# EAGLE design plaits_5u_ioboard (EAGLE 9.1.3)

## Sheet 1 of 2
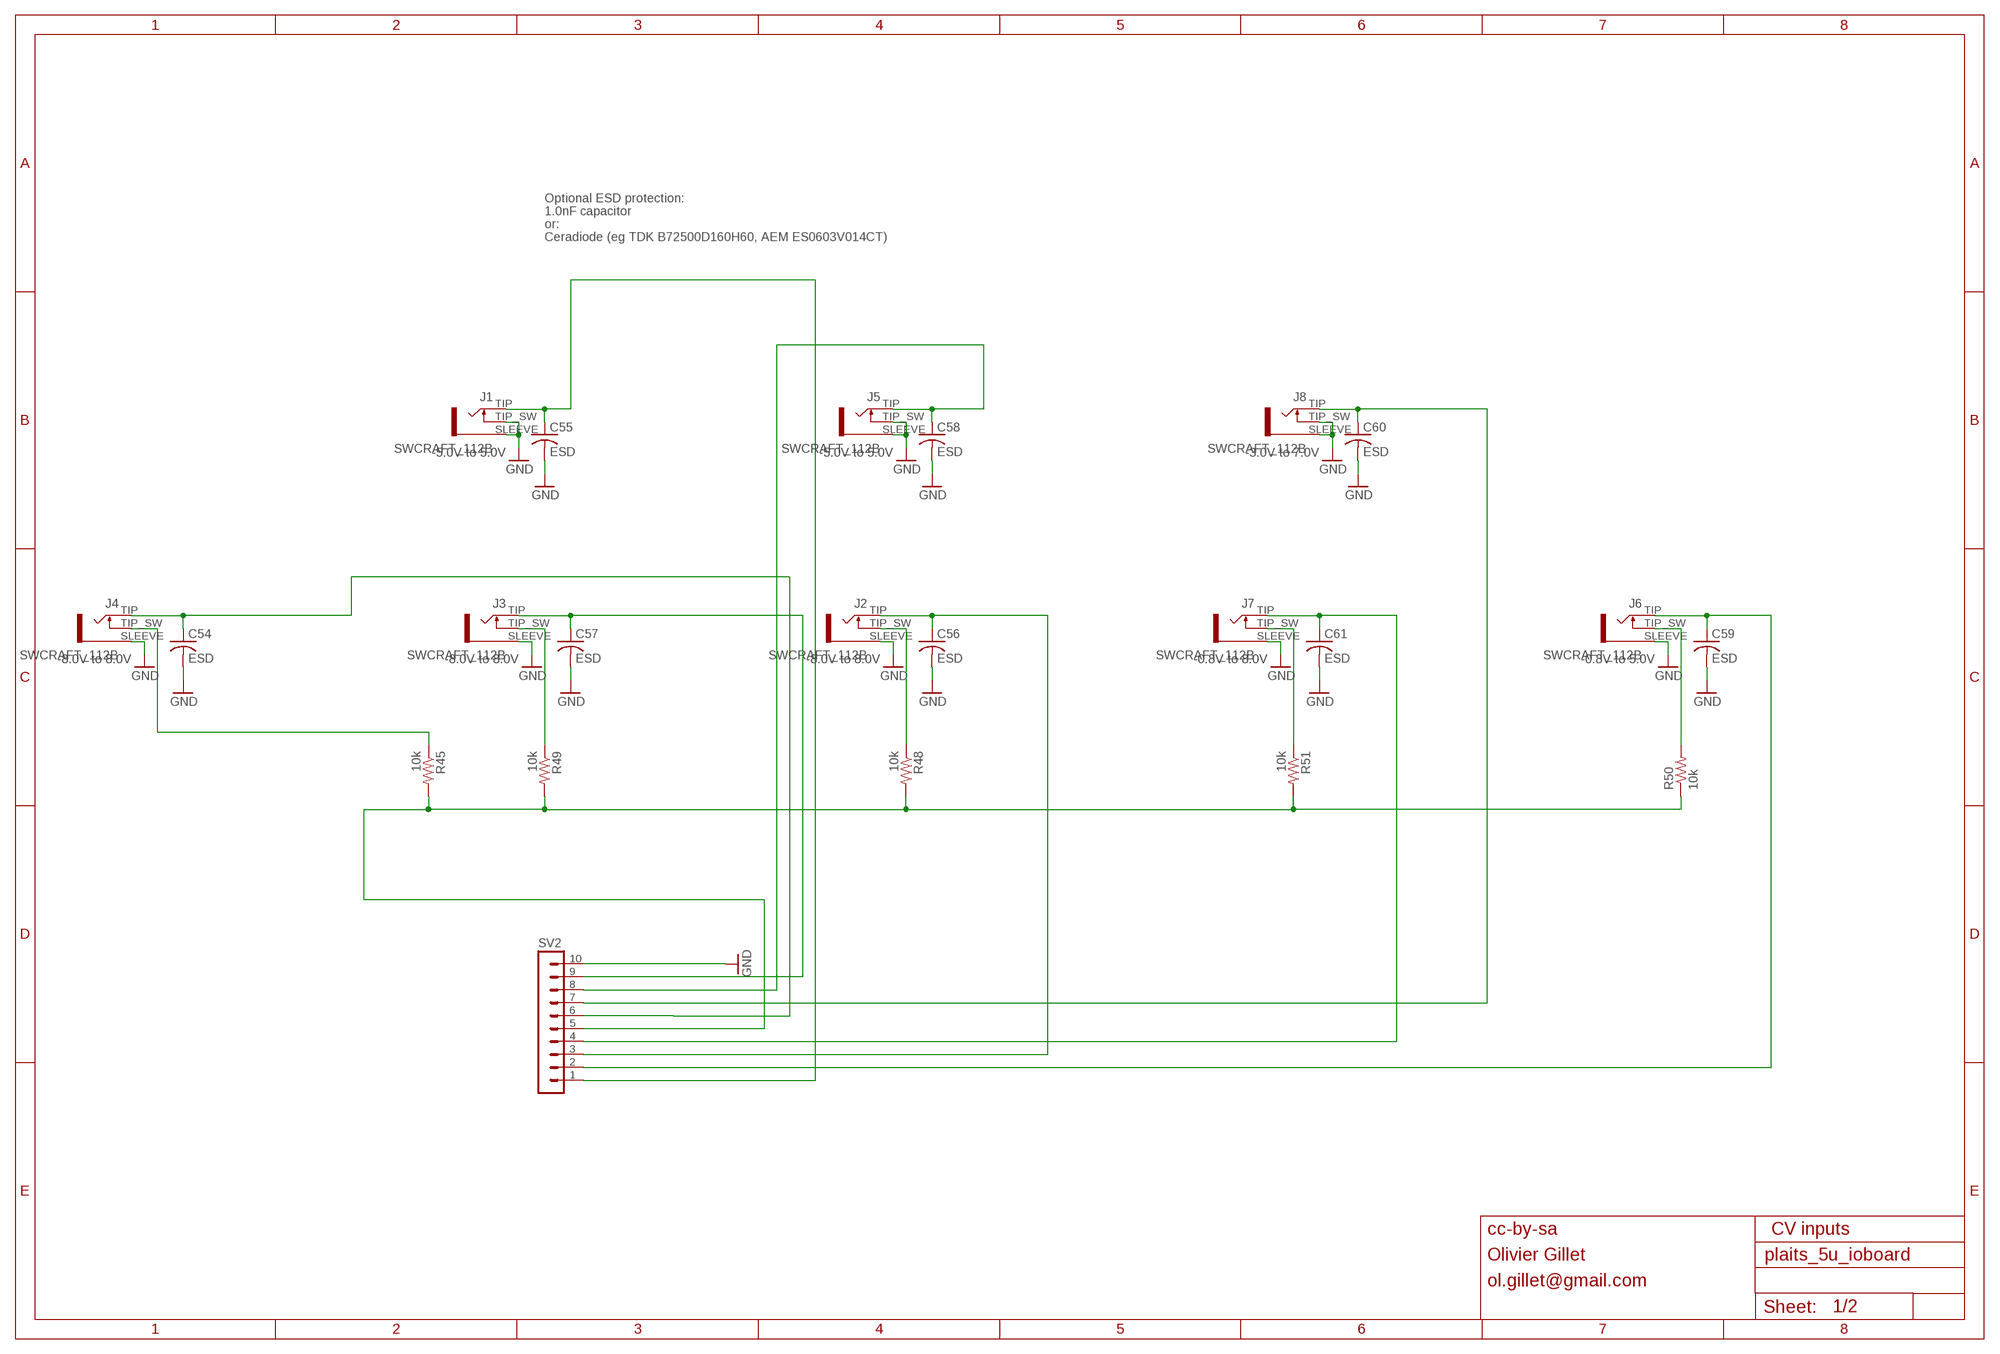
[diagram p0: schematic, sheet 1]

### Parts
C54  ESD  C-USC0805  [C0805]
C55  ESD  C-USC0805  [C0805]
C56  ESD  C-USC0805  [C0805]
C57  ESD  C-USC0805  [C0805]
C58  ESD  C-USC0805  [C0805]
C59  ESD  C-USC0805  [C0805]
C60  ESD  C-USC0805  [C0805]
C61  ESD  C-USC0805  [C0805]
J1  SWCRAFT_112B  [SWCRAFT_112_SLOTS]
J2  SWCRAFT_112B  [SWCRAFT_112_SLOTS]
J3  SWCRAFT_112B  [SWCRAFT_112_SLOTS]
J4  SWCRAFT_112B  [SWCRAFT_112_SLOTS]
J5  SWCRAFT_112B  [SWCRAFT_112_SLOTS]
J6  SWCRAFT_112B  [SWCRAFT_112_SLOTS]
J7  SWCRAFT_112B  [SWCRAFT_112_SLOTS]
J8  SWCRAFT_112B  [SWCRAFT_112_SLOTS]
R45  10k  R-US_R0805  [R0805]
R48  10k  R-US_R0805  [R0805]
R49  10k  R-US_R0805  [R0805]
R50  10k  R-US_R0805  [R0805]
R51  10k  R-US_R0805  [R0805]
SV2  MA10-1  [MA10-1]

### Nets
FM_IN: C57.1 J3.TIP SV2.9
GATE_IN: C61.1 J7.TIP SV2.4
GATE_IN1: C59.1 J6.TIP SV2.2
GND: C54.2 C55.2 C56.2 C57.2 C58.2 C59.2 C60.2 C61.2 J1.SLEEVE J1.TIP_SW J2.SLEEVE J3.SLEEVE J4.SLEEVE J5.SLEEVE J5.TIP_SW J6.SLEEVE J7.SLEEVE J8.SLEEVE J8.TIP_SW SV2.10 ; also sheet 2
HARMONICS_IN: C58.1 J5.TIP SV2.8
MODEL_IN: C55.1 J1.TIP SV2.1
MORPH_IN: C54.1 J4.TIP SV2.6
N$3: J6.TIP_SW R50.2
N$24: J3.TIP_SW R49.1
N$25: J2.TIP_SW R48.1
N$26: J4.TIP_SW R45.1
N$31: C56.1 J2.TIP SV2.3
N$36: J7.TIP_SW R51.1
NORMALIZATION_PROBE: R45.2 R48.2 R49.2 R50.1 R51.2 SV2.5
V_OCT_IN: C60.1 J8.TIP SV2.7

### Notes on the sheet
- Optional ESD protection:
- 1.0nF capacitor
- or:
- Ceradiode (eg TDK B72500D160H60, AEM ES0603V014CT)
- -5.0V to 5.0V | -5.0V to 5.0V | -3.0V to 7.0V
- -8.0V to 8.0V | -8.0V to 8.0V | -8.0V to 8.0V | -0.8V to 8.0V | -0.8V to 5.0V
- cc-by-sa | CV inputs
- Olivier Gillet
- ol.gillet@gmail.com

## Sheet 2 of 2
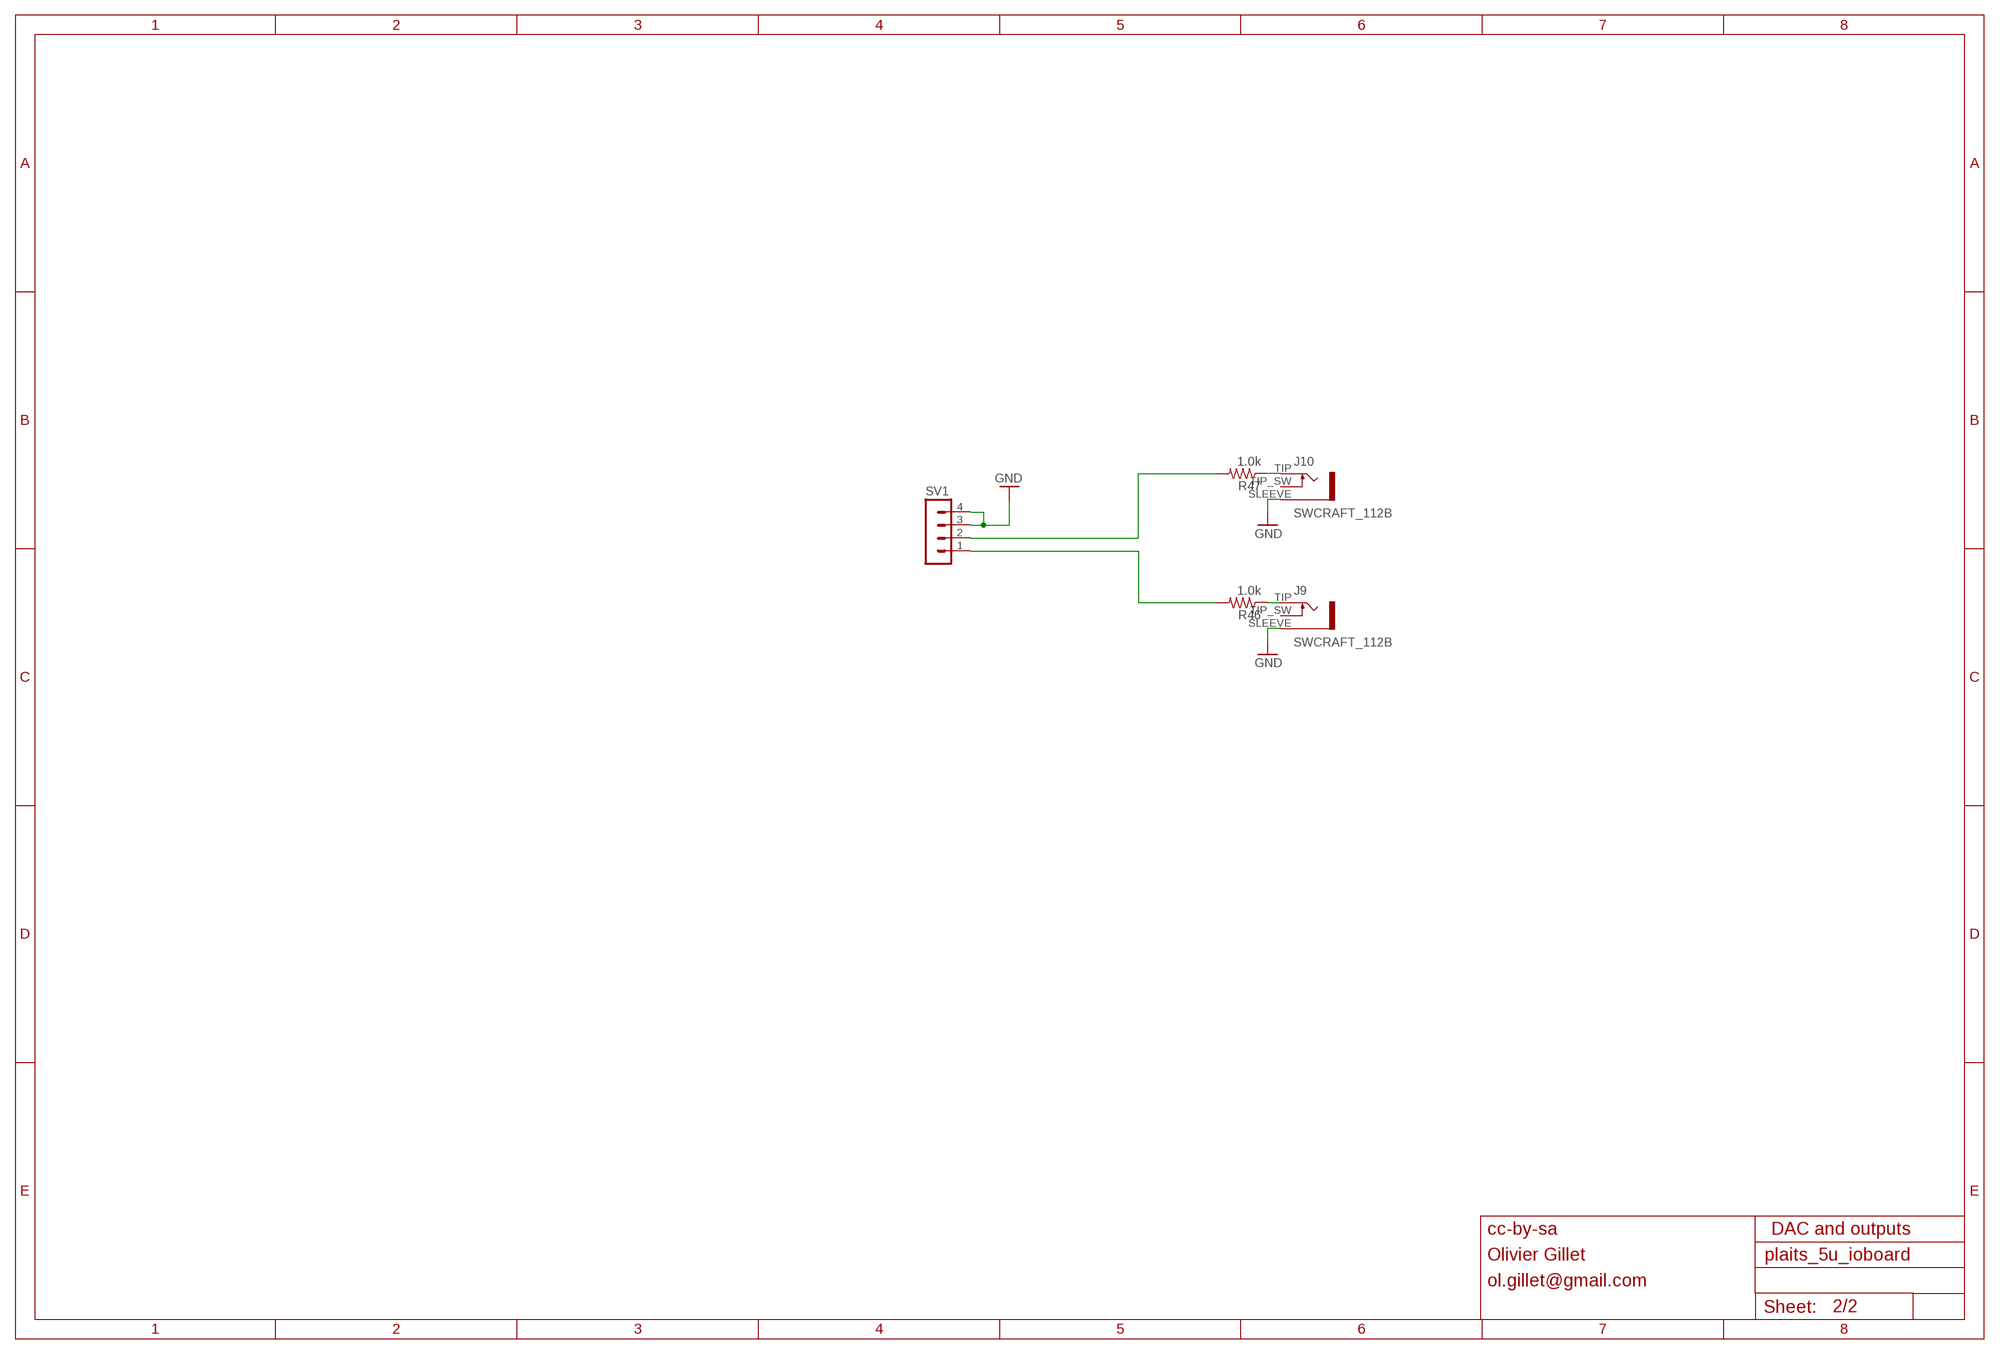
[diagram p1: schematic, sheet 2]

### Parts
J9  SWCRAFT_112B  [SWCRAFT_112_SLOTS]
J10  SWCRAFT_112B  [SWCRAFT_112_SLOTS]
R46  1.0k  R-US_R0805  [R0805]
R47  1.0k  R-US_R0805  [R0805]
SV1  MA04-1  [MA04-1]

### Nets
GND: J9.SLEEVE J10.SLEEVE SV1.3 SV1.4 ; also sheet 1
N$1: R46.2 SV1.1
N$2: R47.2 SV1.2
N$65: J9.TIP R46.1
N$69: J10.TIP R47.1
Unconnected: J9.TIP_SW J10.TIP_SW

### Notes on the sheet
- cc-by-sa | DAC and outputs
- Olivier Gillet
- ol.gillet@gmail.com

## Library data of the parts
C54-C61 = rcl:C-US: CAPACITOR, American symbol
J1-J10 = TomW:SWCRAFT_112B
R45-R51 = rcl:R-US_: RESISTOR, American symbol
SV1 = con-lstb:MA04-1: PIN HEADER; OC_FARNELL: unknown; OC_NEWARK: unknown
SV2 = con-lstb:MA10-1: PIN HEADER; OC_FARNELL: unknown; OC_NEWARK: unknown

## Board
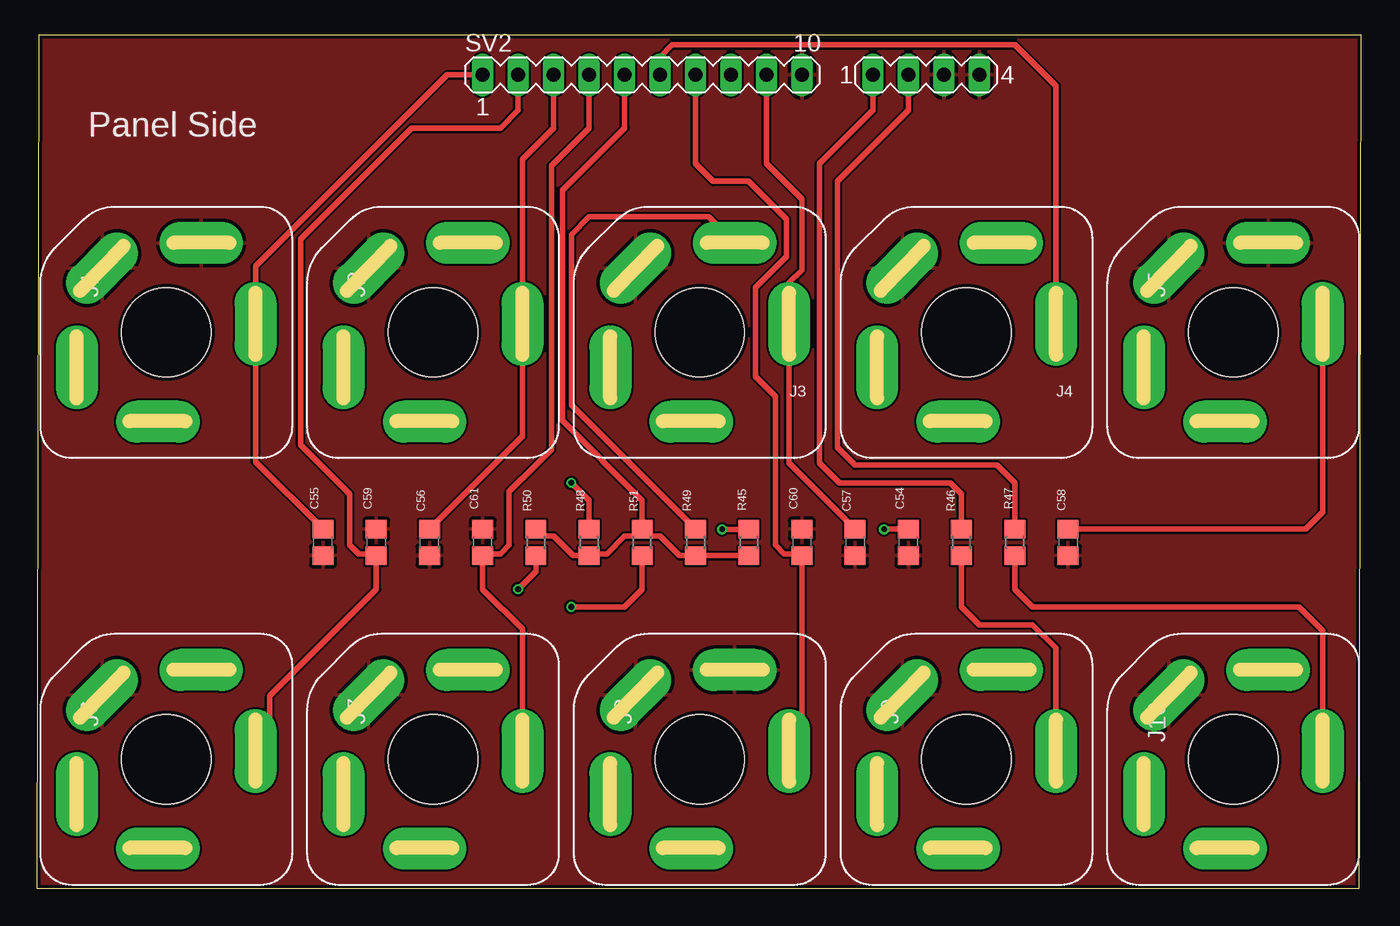
[diagram p2: board, top side]
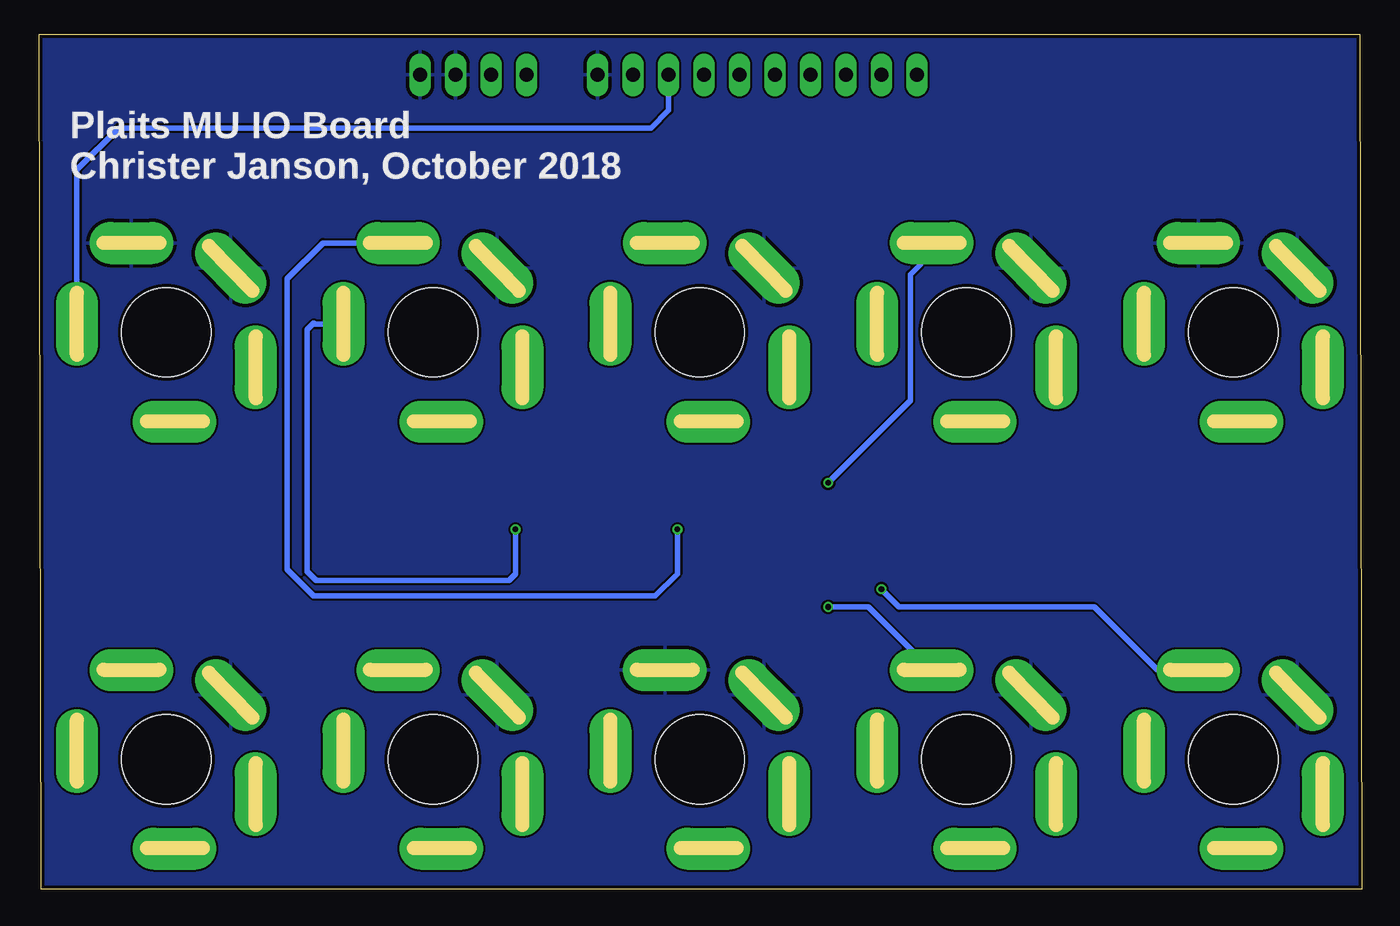
[diagram p3: board, bottom side, seen from below]

Size 94.75 x 61.12 mm. Coordinates in mm from the lower left corner, seen from the top.
Outline: 94.59,0 0,0 0.16,61.12 94.75,61.12 94.59,0
Copper layers (1*16): Top 0.035mm / dielectric 1.5mm / Bottom 0.035mm
Design rules "SeeedStudio_2layer_DRU_no_angle_20140221": minimum track width 6mil, minimum drill 12mil, track to track 6mil, track to pad 6mil, pad to pad 6mil, via to via 6mil, smd to smd 0mil, copper to edge 10mil, drill to drill 10mil, minimum pad ring 10mil, minimum via ring 6mil, stop-mask expansion 2mil, vias tented up to drill 100mil, thermal gap 10mil

### Footprints (pad centres in the part's own frame; a part is rotated, then mirrored left to right if it is on the bottom)
C0805 = smd 1.3 x 1.5: 1 -0.95,0; 2 0.95,0
SWCRAFT_112_SLOTS = drill 0.45 pad 3 long: RING 0.6,6.4; RING_SW 6.4,2.5; SLEEVE 4.6,-4.6; TIP -6.4,-0.6; TIP_SW -2.5,-6.4 | hole 6.4: 0,0
R0805 = smd 1.3 x 1.5: 1 -0.95,0; 2 0.95,0
MA04-1 = drill 1.016 long: 1 -3.81,0; 2 -1.27,0; 3 1.27,0; 4 3.81,0
MA10-1 = drill 1.016 long: 1 -11.43,0; 2 -8.89,0; 3 -6.35,0; 4 -3.81,0; 5 -1.27,0; 6 1.27,0; 7 3.81,0; 8 6.35,0; 9 8.89,0; 10 11.43,0

### Placement (x,y rotation side)
C54  62.37,24.78 270 top
C55  20.46,24.78 270 top
C56  28.08,24.78 270 top
C57  58.56,24.78 270 top
C58  73.8,24.78 270 top
C59  24.27,24.78 90 top
C60  54.75,24.78 90 top
C61  31.89,24.78 90 top
J1  9.24,39.82 180 top
J2  28.34,39.82 180 top
J3  47.43,39.82 180 top
J4  66.53,39.82 180 top
J5  85.62,39.82 180 top
J6  9.24,9.25 180 top
J7  28.34,9.25 180 top
J8  47.43,9.25 180 top
J9  66.53,9.25 180 top
J10  85.62,9.25 180 top
R45  50.94,24.78 270 top
R46  66.18,24.78 90 top
R47  69.99,24.78 90 top
R48  39.51,24.78 270 top
R49  47.13,24.78 270 top
R50  35.7,24.78 270 top
R51  43.32,24.78 90 top
SV1  63.64,58.26 0 top
SV2  43.32,58.26 0 top

### Tracks (layer width: path | path; a pad name or v marks a point on that pad's centre or on a via)
FM_IN
  Top 0.406: SV2.9 52.21,51.91 54.75,49.37 54.75,44.29 53.83,43.38 J3.TIP 53.83,30.46 C57.1
GATE_IN
  Top 0.406: J7.TIP 34.74,18.58 31.89,21.43 C61.1 32.03,23.97 33.16,23.97 33.79,24.61 33.79,28.42 35.7,30.32 36.81,31.43 36.81,41.59 36.81,51.75 39.51,54.45 SV2.4
GATE_IN1
  Top 0.406: J6.TIP 16.65,10.86 16.65,13.81 24.27,21.43 C59.1 24.13,23.97 23,23.97 22.36,24.61 22.36,28.26 18.87,31.75 18.87,46.51 26.81,54.45 33.16,54.45 34.43,55.72 SV2.2
GND
  pour Top: 94.75,61.12 94.75,0 0.14,0 0.14,61.12
  pour Bottom: 94.75,61.12 94.75,0 0.14,0 0.14,61.12
HARMONICS_IN
  Top 0.406: C58.1 90.8,25.73 92.02,26.96 J5.TIP
  Bottom 0.406: SV2.8 49.67,55.72 50.94,54.45 89.04,54.45 92.02,51.47 J5.TIP
MODEL_IN
  Top 0.406: C55.1 15.64,30.55 J1.TIP 15.64,44.55 29.35,58.26 SV2.1
MORPH_IN  (via drill 0.4)
  Top 0.406: C54.1 60.64,25.73 v60.62,25.72 | SV2.6 44.59,59.53 45.46,60.41 69.99,60.41 72.93,57.47 J4.TIP
  Bottom 0.406: v60.62,25.72 60.62,22.54 61.1,22.07 74.91,22.07 75.54,22.7 75.54,40.01 75.07,40.48 75.01,40.42 J4.TIP
N$1
  Top 0.406: R46.2 66.18,28.26 65.38,29.05 57.45,29.05 56.02,30.48 56.02,51.91 59.83,55.72 SV1.1
N$2
  Top 0.406: R47.2 69.99,29.05 68.72,30.32 58.56,30.32 57.29,31.59 57.29,50.64 61.1,54.45 62.37,55.72 SV1.2
N$3  (via drill 0.4)
  Top 0.406: v34.43,21.43 35.7,22.7 R50.2
  Bottom 0.406: J6.TIP_SW 14.68,15.65 19.19,20.16 33.16,20.16 v34.43,21.43
N$24
  Top 0.406: R49.1 38.24,34.62 38.24,46.83 39.51,48.1 48.05,48.1 J3.TIP_SW
N$25  (via drill 0.4)
  Top 0.406: R48.1 39.51,27.78 v38.24,29.05
  Bottom 0.406: v38.24,29.05 32.36,34.93 32.36,43.97 30.84,45.5 J2.TIP_SW
N$26  (via drill 0.4)
  Top 0.406: v49.03,25.72 50.92,25.72 R45.1
  Bottom 0.406: v49.03,25.72 49.03,22.54 50.62,20.96 75.07,20.96 76.97,22.86 76.97,43.66 74.41,46.22 J4.TIP_SW
N$31
  Top 0.406: SV2.3 36.97,54.45 34.74,52.22 34.74,40.48 J2.TIP 34.74,32.39 C56.1
N$36  (via drill 0.4)
  Top 0.406: v38.24,20.16 42.05,20.16 43.32,21.43 R51.1
  Bottom 0.406: J7.TIP_SW 35.35,20.16 v38.24,20.16
N$65
  Top 0.406: J9.TIP 72.93,17.22 71.26,18.89 67.45,18.89 66.18,20.16 R46.1
N$69
  Top 0.406: J10.TIP 92.02,18.45 90.31,20.16 71.26,20.16 69.99,21.43 R47.1
NORMALIZATION_PROBE
  Top 0.406: R50.1 36.19,25.24 36.97,25.24 38.38,23.83 R48.2 39.65,23.97 40.78,23.97 42.05,25.24 43.32,25.24 | 43.32,25.24 R51.2 43.32,27.78 37.6,33.5 37.6,50.01 42.05,54.45 SV2.5 | 43.32,25.24 44.59,25.24 46,23.83 R49.2 R45.2
V_OCT_IN
  Top 0.406: J8.TIP 54.75,10.77 C60.1 54.61,23.97 53.48,23.97 52.84,24.61 52.84,35.24 51.41,36.67 51.41,43.02 53.64,45.24 53.64,47.94 50.94,50.64 48.4,50.64 47.13,51.91 SV2.7

### Text on the board
tNames: Panel Side
bNames: Plaits MU IO Board / Christer Janson, October 2018
tStop: Plaits | cc-by-sa | 2017. v5 | Olivier Gillet
tTest: Include Layer 46 in Gerber for milling